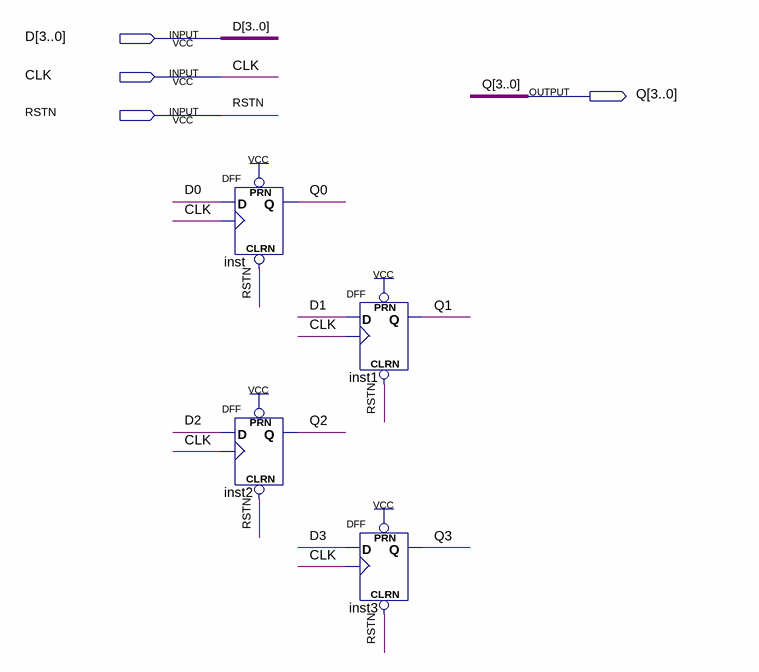
[diagram p0: schematic sheet]
// Quartus schematic reg4.bdf as structural Verilog: 4 symbols, 4 pins
module reg4 (
  input  [3:0] D,
  input  CLK,
  input  RSTN,
  output [3:0] Q
);

  DFF inst (.CLRN(RSTN), .CLK(CLK), .D(D[0]), .PRN(1'b1), .Q(Q[0]));
  DFF inst2 (.CLRN(RSTN), .CLK(CLK), .D(D[2]), .PRN(1'b1), .Q(Q[2]));
  DFF inst1 (.CLRN(RSTN), .CLK(CLK), .D(D[1]), .PRN(1'b1), .Q(Q[1]));
  DFF inst3 (.CLRN(RSTN), .CLK(CLK), .D(D[3]), .PRN(1'b1), .Q(Q[3]));
endmodule
